# Altium schematic sheet transceiver.SchDoc
size A4
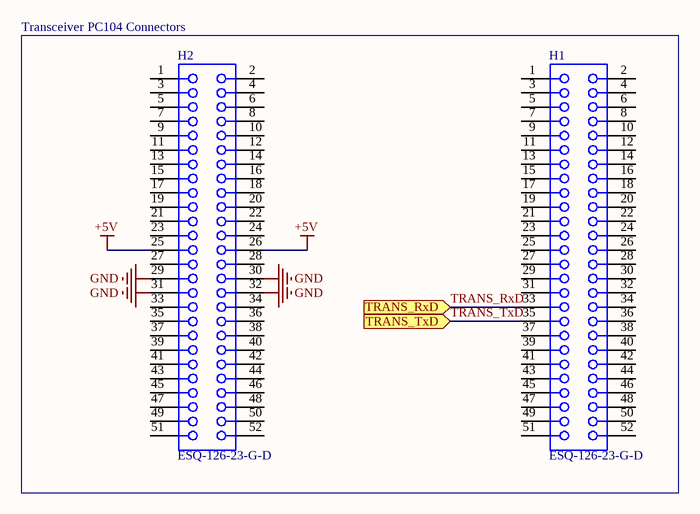
[diagram p0: transceiver.SchDoc]

## Parts
H1  ESQ-126-23-G-D  [SSW-126-01-G-D]
H2  ESQ-126-23-G-D  [SSW-126-01-G-D]

## Blocks framed on the sheet
Transceiver PC104 Connectors: H1 H2

## Ports
TRANS_RxD (in), TRANS_TxD (in)

## Nets
+5V: H2.25 H2.26
GND: H2.29 H2.30 H2.31 H2.32
TRANS_RxD: H1.33 ; port TRANS_RxD
TRANS_TxD: H1.35 ; port TRANS_TxD

Not connected (* = marked no-connect by the designer): H1 1 2 3 4 5 6 7 8 9 10 11 12 13 14 15 16 17 18 19 20 21 22 23 24 25 26 27 28 29 30 31 32 34 36 37 38 39 40 41 42 43 44 45 46 47 48 49 50 51 52; H2 1 2 3 4 5 6 7 8 9 10 11 12 13 14 15 16 17 18 19 20 21 22 23 24 27 28 33 34 35 36 37 38 39 40 41 42 43 44 45 46 47 48 49 50 51 52

## Library data of the parts
H1 H2 = ESQ-126-23-G-D: PC/104(TM) Elevated Socket Strip, Through-hole, Vertical, -55 to 125 degC, 2.54 mm Pitch, 52-Pin, Female, RoHS; Manufacturer: Samtec; Pitch: 2.54 mm; DatasheetVersion: F-214; PackageVersion: BZ, 9/1998; PackageReference: ESQ-126-23-X-D; PackageDescription: ESQ Strip ASM; Supplier 1: Newark; Supplier Part Number 1: 92P1348; Orientation: Vertical; RoHS: True; Temperature Range: -55 to 125 degC; Mounting Technology: Through-hole; PartNumber: ESQ-126-23-G-D; ComponentLink1Description: Manufacturer URL; ComponentLink1URL: http://www.samtec.com; ComponentLink2Description: Datasheet; ComponentLink2URL: http://www.samtec.com/documents/webfiles/pdf/ESQ_TH.PDF; ComponentLink3Description: Package Specification; ComponentLink3URL: http://www.samtec.com/documents/webfiles/cpdf/ESQ-1XX-XX-X-X-XXX-XX-X-XX-MKT.pdf
  H1: Supplier 2: Digi-Key; Supplier Part Number 2: ESQ-126-23-G-D-ND